# EAGLE design MouseGoggles MiniBrdAA-1-0 (EAGLE 9.6.2)
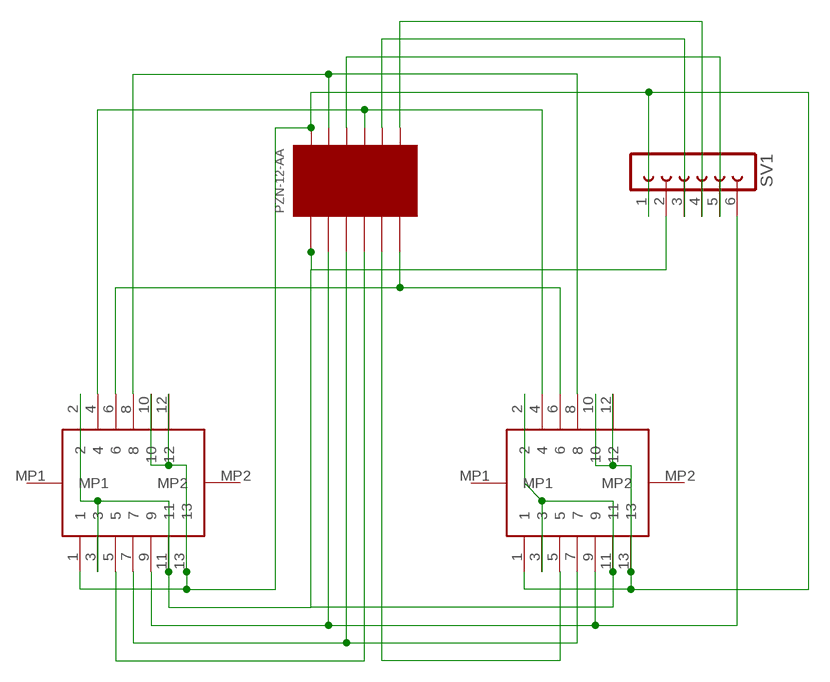
[diagram p0: schematic, sheet 1]

## Parts
J1  1-2328724-3  [123287243]
J2  1-2328724-3  [123287243]
SV1  FE06-1  [FE06]
U$1  PZN_12_AA  [OMN_PZN_NANO_6X2]

## Nets
N$1: J1.2 J1.3 J1.11 J2.2 J2.3 J2.11 SV1.2 U$1.P$2
N$2: J1.1 J1.10 J1.12 J1.13 J2.1 J2.10 J2.12 J2.13 SV1.1 U$1.P$1
N$3: J1.9 J2.9 SV1.6 U$1.P$4
N$4: J1.7 J2.7 U$1.P$6
N$5: J1.5 U$1.P$8
N$6: J2.5 U$1.P$10
N$7: J1.6 J2.6 U$1.P$12
N$8: J1.8 J2.8 U$1.P$3
N$9: J1.4 J2.4 U$1.P$7
N$10: SV1.5 U$1.P$5
N$11: SV1.3 U$1.P$9
N$12: SV1.4 U$1.P$11
Unconnected: J1.MP1 J1.MP2 J2.MP1 J2.MP2

## Library data of the parts
J1 J2 = 1-2328724-3:1-2328724-3: AMP - TE CONNECTIVITY - 1-2328724-3 - CONNECTOR, FPC, R/A, 13POS, 1ROW, 0.3MM Source: Datasheet <https://www.te.com/commerce/DocumentDelivery/DDEController?Action=showdoc&DocId=Customer Drawing23287243pdfEnglishENG_CD_2328724_3.pdf1-2328724-3>; DESCRIPTION: AMP - TE CONNECTIVITY - 1-2328724-3 - CONNECTOR, FPC, R/A, 13POS, 1ROW, 0.3MM; HEIGHT: 1.1mm; MANUFACTURER_NAME: TE Connectivity; MANUFACTURER_PART_NUMBER: 1-2328724-3; MOUSER_PART_NUMBER: 571-1-2328724-3; MOUSER_PRICE-STOCK: https://www.mouser.co.uk/ProductDetail/TE-Connectivity/1-2328724-3?qs=w%2Fv1CP2dgqo8aBCjMy0R7g%3D%3D
SV1 = con-lsta:FE06-1: FEMALE HEADER; OC_FARNELL: unknown; OC_NEWARK: unknown
U$1 = PZN_12_AA:PZN_12_AA

## Board
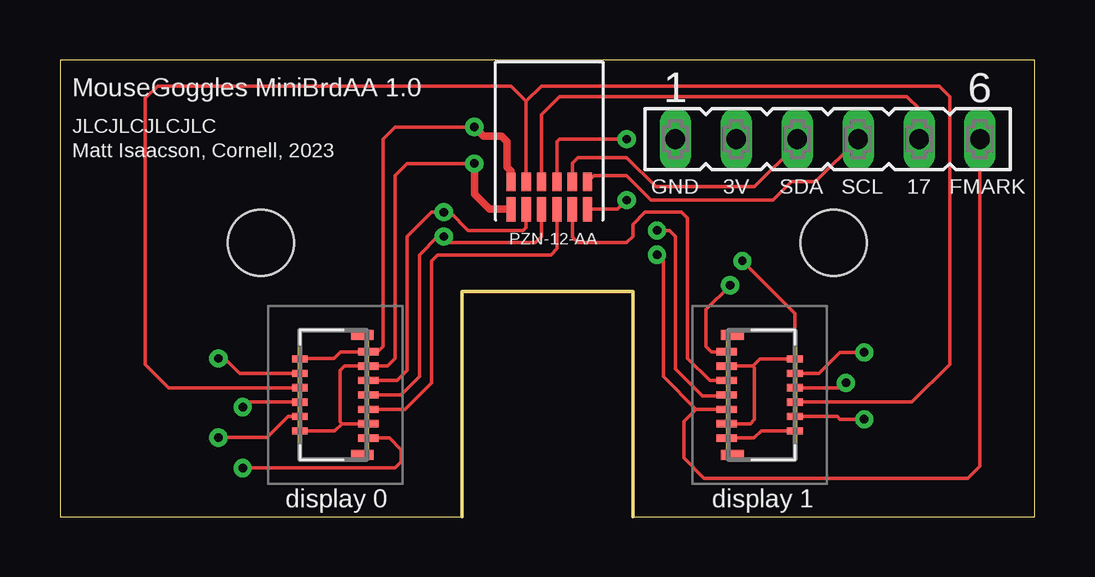
[diagram p1: board, top side]
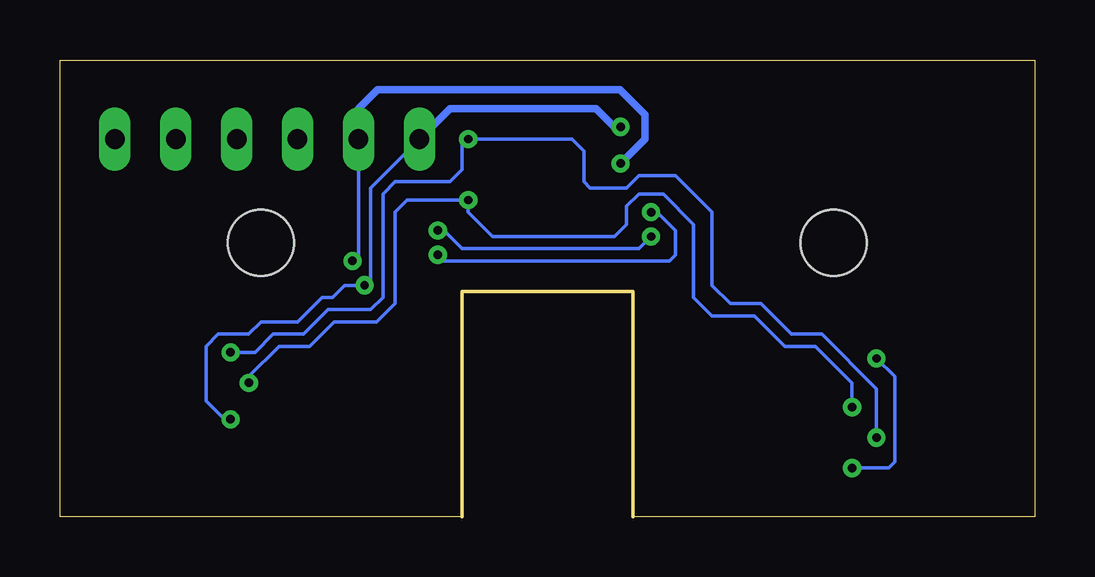
[diagram p2: board, bottom side, seen from below]

Size 40.64 x 19.05 mm. Coordinates in mm from the lower left corner, seen from the top.
Outline: 0,0 16.76,0 16.76,9.4 23.88,9.4 23.88,0 40.64,0 40.64,19.05 0,19.05 0,0
Copper layers (1*16): Top 0.035mm / dielectric 1.5mm / Bottom 0.035mm
Design rules "default *": minimum track width 6mil, minimum drill 0.35mm, track to track 0.2mm, track to pad 0.2mm, pad to pad 0.2mm, via to via 0.2mm, smd to smd 0.2mm, copper to edge 40mil, drill to drill 6mil, minimum pad ring 10mil, minimum via ring 8mil, stop-mask expansion 4mil, vias tented up to drill 0mil, thermal gap 10mil
Holes 2.75 mm at 32.26,11.43 8.38,11.43

### Footprints (pad centres in the part's own frame; a part is rotated, then mirrored left to right if it is on the bottom)
123287243 = smd 0.3 x 0.85: 1 -1.8,-1.425; 3 -1.2,-1.425; 5 -0.6,-1.425; 7 0,-1.425; 9 0.6,-1.425; 11 1.2,-1.425; 13 1.8,-1.425 | smd 0.3 x 0.65: 2 -1.5,1.425; 4 -0.9,1.425; 6 -0.3,1.425; 8 0.3,1.425; 10 0.9,1.425; 12 1.5,1.425 | smd 0.4 x 0.95: MP1 -2.5,-1.175; MP2 2.5,-1.175
FE06 = drill 0.813 long: 1 -6.35,0; 2 -3.81,0; 3 -1.27,0; 4 1.27,0; 5 3.81,0; 6 6.35,0
OMN_PZN_NANO_6X2 = smd 0.76 x 0.38: P$1 0,0; P$3 0,0.64; P$5 0,1.28; P$7 0,1.92; P$9 0,2.56; P$11 0,3.2 | smd 1.02 x 0.38: P$2 1.14,0; P$4 1.14,0.64; P$6 1.14,1.28; P$8 1.14,1.92; P$10 1.14,2.56; P$12 1.14,3.2

### Placement (x,y rotation side)
J1  11.43,5.08 90 top
J2  29.21,5.08 270 top
SV1  32,15.75 0 top
U$1  18.8,13.97 270 top

### Tracks (layer width: path | path; a pad name or v marks a point on that pad's centre or on a via)
N$1  (via drill 0.35)
  Top 0.152: J1.2 11.45,3.58 11.75,3.88 | 11.75,3.88 J1.3 | 11.75,3.88 11.68,3.95 11.68,6.1 11.87,6.28 J1.11 13.65,6.28 13.97,6.6 13.97,14.22 14.48,14.73 v17.27,14.73 | 28.89,6.28 29.19,6.58 J2.2 30.64,8.48 v28.45,10.67 | J2.3 28.89,6.28 | J2.11 28.77,3.88 28.96,4.06 28.96,6.21 28.89,6.28
  Top 0.305: U$1.P$2 17.9,12.83 17.27,13.46 v17.27,14.73
  Bottom 0.152: SV1.2 28.19,10.67 v28.45,10.67
  Bottom 0.305: SV1.2 28.19,17.02 27.41,17.8 17.3,17.8 16.26,16.76 16.26,15.75 v17.27,14.73
N$2  (via drill 0.35)
  Top 0.152: J2.13 28.93,3.28 29.23,3.58 J2.12 J2.10 32.4,4.18 32.51,4.06 v33.53,4.06 | v17.27,16.26 13.97,16.26 13.46,15.75 13.46,7.11 13.23,6.88 J1.13 11.71,6.88 11.43,6.6 10.03,6.6 J1.12 J1.10 7.48,5.98 6.86,6.6 v6.6,6.6 | J2.1 27.16,6.88 26.92,7.11 26.92,8.64 v27.94,9.65 | J1.1 13.74,3.28 14.22,2.79 14.22,2.29 13.97,2.03 v7.62,2.03
  Top 0.305: v17.27,16.26 17.65,15.88 18.41,15.88 18.64,15.65 18.64,14.58 18.8,14.42 U$1.P$1
  Bottom 0.152: v7.62,2.03 6.1,2.03 5.84,2.29 5.84,5.84 v6.6,6.6 | v33.53,4.06 33.78,4.06 34.54,4.83 34.54,7.11 34.04,7.62 32.77,7.62 32.26,8.13 30.73,8.13 29.72,9.14 29.28,9.14 28.77,9.65 v27.94,9.65 27.69,9.91 27.69,13.72 SV1.1
  Bottom 0.305: SV1.1 24.38,17.02 18.29,17.02 17.53,16.26 v17.27,16.26
N$3  (via drill 0.35)
  Top 0.152: J1.9 14.06,5.68 14.48,6.1 14.48,11.68 15.49,12.7 v16,12.7 16.26,12.7 17.02,11.94 19.3,11.94 19.44,12.07 U$1.P$4 | J2.9 26.51,4.48 | 26.51,4.48 25.15,5.84 25.15,10.67 v24.89,10.92 | SV1.6 38.35,2.11 37.85,1.6 26.85,1.6 26,2.45 26,3.97 26.51,4.48
  Bottom 0.152: v24.89,10.92 24.64,10.67 15.24,10.67 14.99,10.92 14.99,11.94 15.75,12.7 v16,12.7
N$4  (via drill 0.35)
  Top 0.152: J1.7 14.22,5.08 14.99,5.84 14.99,10.92 15.75,11.68 v16,11.68 16.26,11.43 19.82,11.43 20.08,11.68 U$1.P$6 | J2.7 27.75,5.05 26.78,5.05 25.65,6.17 25.65,11.68 25.4,11.94 v24.89,11.94
  Bottom 0.152: v24.89,11.94 24.64,11.94 23.88,11.18 16.51,11.18 v16,11.68
N$5
  Top 0.152: J1.5 14.39,4.48 15.49,5.59 15.49,10.67 15.75,10.92 20.46,10.92 20.72,11.18 U$1.P$8
N$6
  Top 0.152: J2.5 27.09,5.68 26.16,6.6 26.16,12.45 25.91,12.7 24.38,12.7 23.88,12.19 23.88,11.68 23.62,11.43 21.59,11.43 21.36,11.66 U$1.P$10
N$7  (via drill 0.35)
  Top 0.152: U$1.P$12 23.24,12.83 v23.62,13.21 | J2.6 32.56,5.38 v32.77,5.59 | J1.6 7.83,4.78 v7.62,4.57
  Bottom 0.152: v32.77,5.59 32.77,5.84 31.5,7.11 30.23,7.11 29.21,8.13 27.43,8.13 26.67,8.89 26.67,9.4 26.67,12.7 26.16,13.21 v23.62,13.21 23.62,12.7 22.61,11.68 17.53,11.68 17.02,12.19 17.02,12.95 16.51,13.46 15.49,13.46 14.22,12.19 14.22,9.14 13.46,8.38 11.68,8.38 10.41,7.11 9.14,7.11 7.62,5.59 v7.62,4.57
N$8
  Top 0.152: 19.44,16.12 U$1.P$3 19.44,17.33 | 30.68,4.83 J2.8 35.51,4.78 37.08,6.35 37.08,17.53 36.65,17.96 20.07,17.96 19.44,17.33 | J1.8 4.53,5.38 3.56,6.35 3.56,17.45 4.06,17.96 18.81,17.96 19.44,17.33
N$9  (via drill 0.35)
  Top 0.152: U$1.P$7 20.72,15.64 20.83,15.75 v23.62,15.75 | J1.4 9.51,4.18 8.64,3.3 v6.6,3.3 | J2.4 31.63,5.98 32.51,6.86 v33.53,6.86
  Bottom 0.152: v6.6,3.3 6.6,5.33 8.89,7.62 10.16,7.62 11.43,8.89 12.7,8.89 13.46,9.65 13.46,12.7 14.99,14.22 16.51,14.22 17.02,13.72 18.54,13.72 18.8,13.97 18.8,15.24 19.3,15.75 v23.62,15.75 23.88,15.49 23.88,14.48 24.38,13.97 26.67,13.97 27.18,13.46 27.18,9.14 27.69,8.64 29.46,8.64 30.48,7.62 31.75,7.62 32.51,6.86 v33.53,6.86
N$10
  Top 0.152: U$1.P$5 20.08,16.77 20.83,17.53 35.31,17.53 35.81,17.02 SV1.5
N$11
  Top 0.152: U$1.P$9 21.36,14.75 21.59,14.99 23.62,14.99 24.84,13.77 28.96,13.77 30.73,15.54 SV1.3
N$12
  Top 0.152: U$1.P$11 22.25,14.22 23.62,14.22 24.64,13.21 29.72,13.21 30.48,13.97 31.5,13.97 SV1.4

### Text on the board
tNames: MouseGoggles MiniBrdAA 1.0 | JLCJLCJLCJLC | Matt Isaacson, Cornell, 2023 | GND 3V SDA SCL 17 FMARK | display 0 | display 1